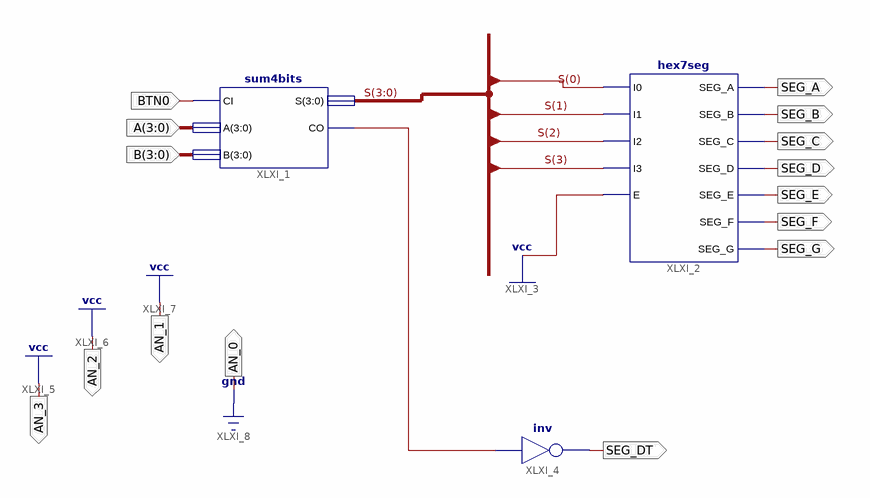
[diagram p0: schematic sheet 1]
// Xilinx ISE schematic top_sumador.sch (spartan3e) as structural Verilog: 3 symbols, 15 ports
module top_sumador (
  input  [3:0] A,
  input  [3:0] B,
  input  BTN0,
  output SEG_DT,
  output SEG_A,
  output SEG_B,
  output SEG_C,
  output SEG_D,
  output SEG_E,
  output SEG_F,
  output SEG_G,
  output AN_3,
  output AN_2,
  output AN_1,
  output AN_0
);

  wire XLXN_8;
  wire [3:0] S;

  sum4bits XLXI_1 (.A(A), .B(B), .CI(BTN0), .CO(XLXN_8), .S(S));
  hex7seg XLXI_2 (
    .E(1'b1), .I0(S[0]), .I1(S[1]), .I2(S[2]), .I3(S[3]), .SEG_A(SEG_A), .SEG_B(SEG_B), .SEG_C(SEG_C),
    .SEG_D(SEG_D), .SEG_E(SEG_E), .SEG_F(SEG_F), .SEG_G(SEG_G));
  not XLXI_4 (SEG_DT, XLXN_8);

  assign AN_0 = 1'b0;
  assign AN_1 = 1'b1;
  assign AN_2 = 1'b1;
  assign AN_3 = 1'b1;
endmodule
